# EAGLE design 1LFO_v2 (EAGLE 7.1.0)
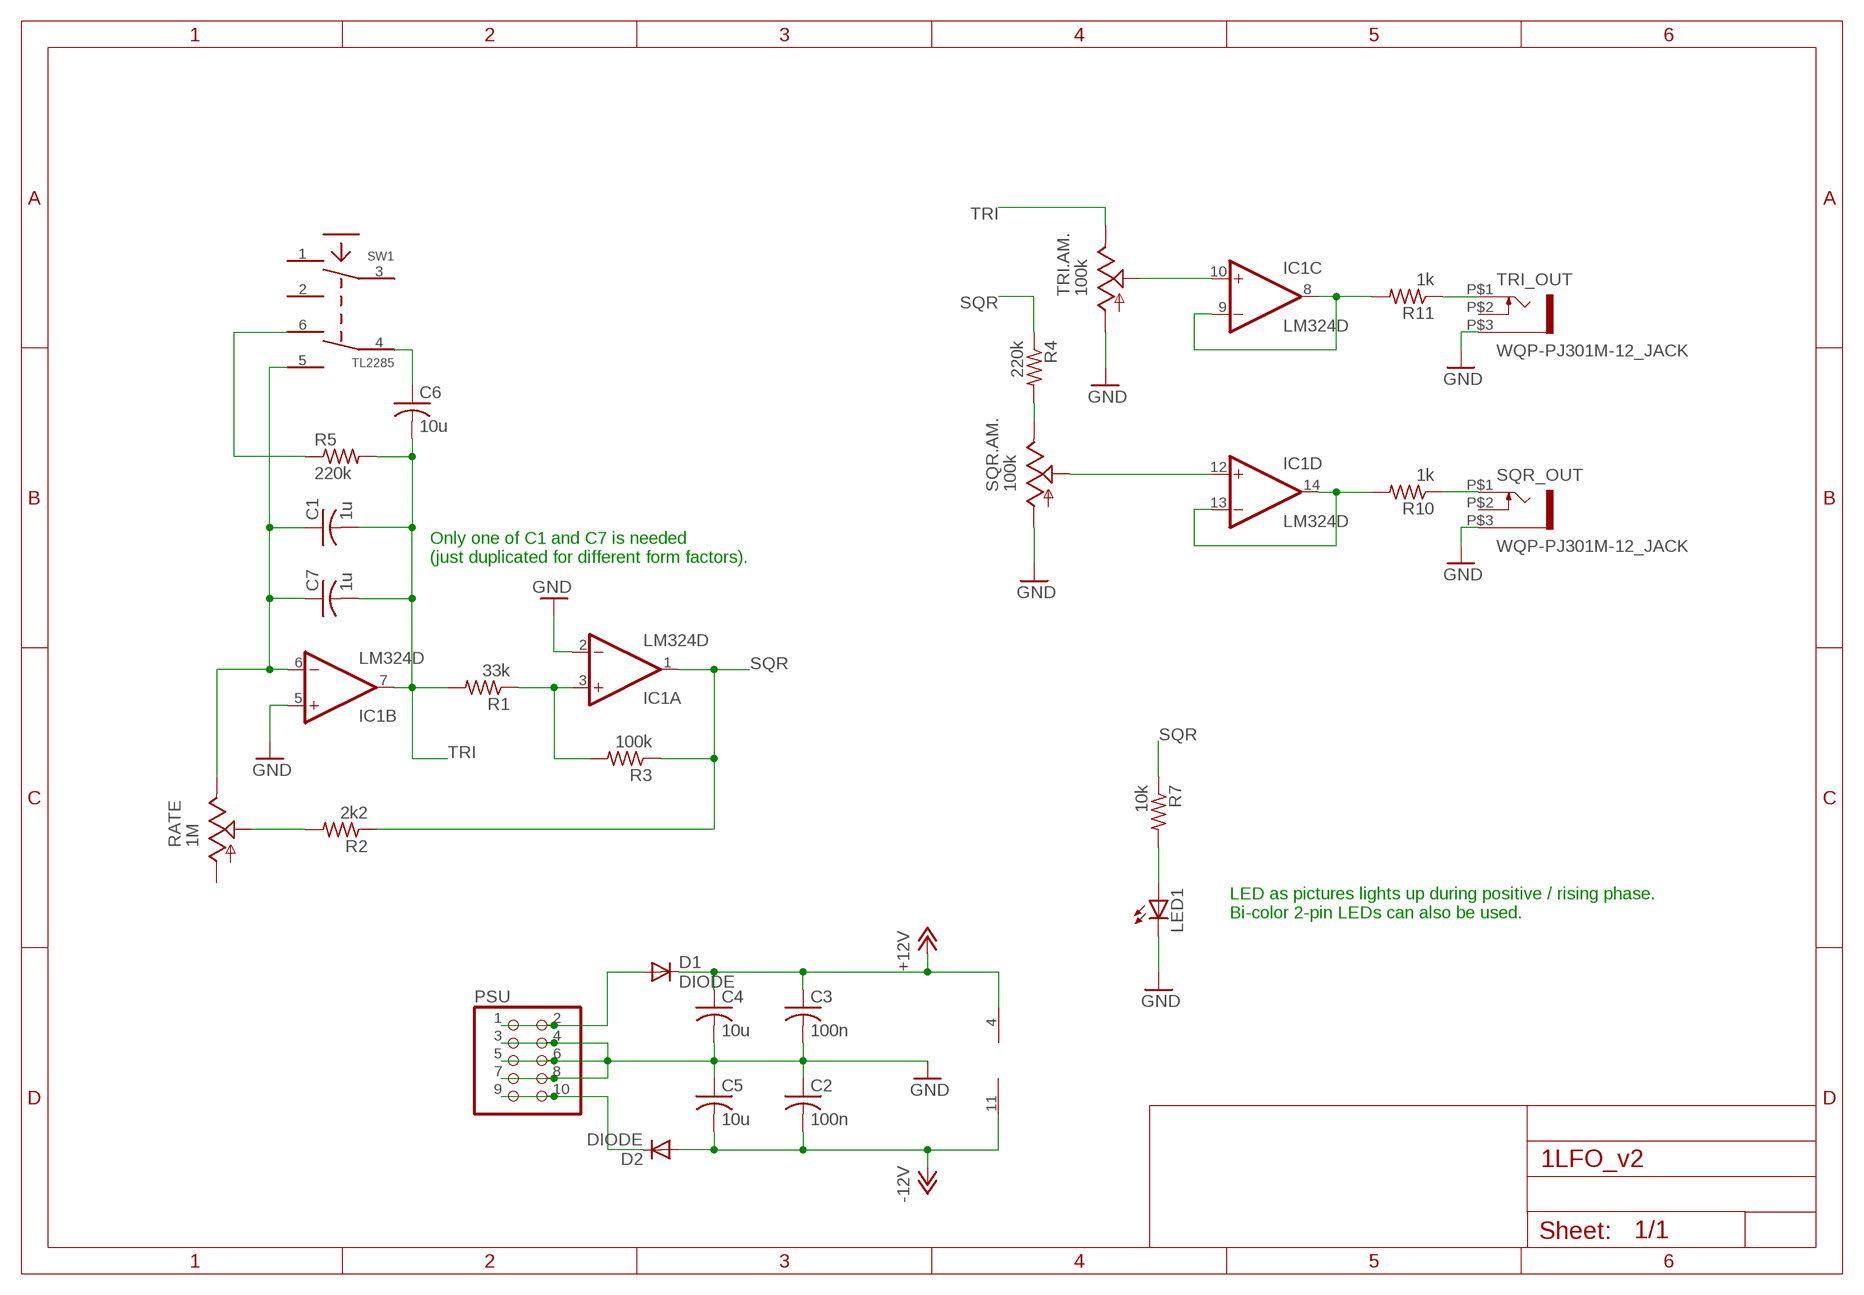
[diagram p0: schematic, sheet 1]

## Parts
C1  1u  C-USC1206K  [C1206K]
C2  100n  C-USC0603K  [C0603K]
C3  100n  C-USC0603K  [C0603K]
C4  10u  C-USC1206K  [C1206K]
C5  10u  C-USC1206K  [C1206K]
C6  10u  C-USC1206K  [C1206K]
C7  1u  C-USC0603K  [C0603K]
D1  DIODE  DIODE-DO214AA  [DO214AA]
D2  DIODE  DIODE-DO214AA  [DO214AA]
IC1  LM324D  [SO14]
LED1  LED5MM  [LED5MM]
PSU  PINHD-2X5  [2X05]
R1  33k  R-US_R0603  [R0603]
R2  2k2  R-US_R0603  [R0603]
R3  100k  R-US_R0603  [R0603]
R4  220k  R-US_R0603  [R0603]
R5  220k  R-US_R0603  [R0603]
R7  10k  R-US_R0603  [R0603]
R10  1k  R-US_R0603  [R0603]
R11  1k  R-US_R0603  [R0603]
RATE  1M  POT_USVERTICAL  [ALPS_POT_VERTICAL]
SQR.AM.  100k  POT_USVERTICAL  [ALPS_POT_VERTICAL]
SQR_OUT  WQP-PJ301M-12_JACK  [WQP-PJ301M-12_JACK]
SW1  TL2285  [TL2285_PCB]
TRI.AM.  100k  POT_USVERTICAL  [ALPS_POT_VERTICAL]
TRI_OUT  WQP-PJ301M-12_JACK  [WQP-PJ301M-12_JACK]

## Nets
+12V: C3.1 C4.1 D1.C IC1.4(P:V+)
-12V: C2.2 C5.2 D2.A IC1.11(P:V-)
GND: C2.1 C3.2 C4.2 C5.1 IC1.2(A:-IN) IC1.5(B:+IN) LED1.K(C) PSU.3 PSU.4 PSU.5 PSU.6 PSU.7 PSU.8 SQR.AM..P$3(A) SQR_OUT.P$3 TRI.AM..P$3(A) TRI_OUT.P$3
N$1: C1.1 C7.1 IC1.6(B:-IN) RATE.P$1(E) SW1.5
N$2: IC1.12(D:+IN) SQR.AM..P$2(S)
N$3: R4.2 SQR.AM..P$1(E)
N$4: C6.1 SW1.4
N$5: IC1.3(A:+IN) R1.1 R3.2
N$6: R5.1 SW1.6
N$7: R2.2 RATE.P$2(S)
N$8: IC1.8(C:OUT) IC1.9(C:-IN) R11.2
N$9: IC1.10(C:+IN) TRI.AM..P$2(S)
N$10: D1.A PSU.1 PSU.2
N$11: D2.C PSU.9 PSU.10
N$13: LED1.A R7.2
N$14: IC1.13(D:-IN) IC1.14(D:OUT) R10.2
N$17: R11.1 TRI_OUT.P$1
N$19: R10.1 SQR_OUT.P$1
SQR: IC1.1(A:OUT) R2.1 R3.1 R4.1 R7.1
TRI: C1.2 C6.2 C7.2 IC1.7(B:OUT) R1.2 R5.2 TRI.AM..P$1(E)
Unconnected: RATE.P$3(A) SQR_OUT.P$2 SW1.1 SW1.2 SW1.3 TRI_OUT.P$2

## Notes on the sheet
- Only one of C1 and C7 is needed
  (just duplicated for different form factors).
- LED as pictures lights up during positive / rising phase. 
  Bi-color 2-pin LEDs can also be used.

## Library data of the parts
C1-C7 = rcl:C-US: CAPACITOR, American symbol
D1 D2 = diode:DIODE-: DIODE
IC1 = linear:LM324: OP AMP
LED1 = led:LED: LED OSRAM: - CHIPLED LG R971, LG N971, LY N971, LG Q971, LY Q971, LO R971, LY R971 LH N974, LH R974 LS Q976, LO Q976, LY Q976 LO Q996 - Hyper CHIPLED LW Q18S LB Q993, LB Q99A, LB R99A - SideLED LS A670, LO A670, LY A670, LG A670, LP A670 LB A673, LV A673, LT A673, LW A673 LH A674 LY A675 LS A676, LA A676, LO A676, LY A676, LW A676 LS A679, LY A679, LG A679 - Hyper Micro SIDELED® LS Y876, LA Y876, LO Y876, LY Y876 LT Y87S - SmartLED LW L88C, LW L88S LB L89C, LB L89S, LG L890 LS L89K, LO L89K, LY L89K LS L896, LA L896, LO L896, LY L896 - TOPLED LS T670, LO T670, LY T670, LG T670, LP T670 LSG T670, LSP T670, LSY T670, LOP T670, LYG T670 LG T671, LOG T671, LSG T671 LB T673, LV T673, LT T673, LW T673 LH T674 LS T676, LA T676, LO T676, LY T676, LB T676, LH T676, LSB T676, LW T676 LB T67C, LV T67C, LT T67C, LS T67K, LO T67K, LY T67K, LW E67C LS E67B, LA E67B, LO E67B, LY E67B, LB E67C, LV E67C, LT E67C LW T67C LS T679, LY T679, LG T679 LS T770, LO T770, LY T770, LG T770, LP T770 LB T773, LV T773, LT T773, LW T773 LH T774 LS E675, LA E675, LY E675, LS T675 LS T776, LA T776, LO T776, LY T776, LB T776 LHGB T686 LT T68C, LB T68C - Hyper Mini TOPLED® LB M676 - Mini TOPLED Santana® LG M470 LS M47K, LO M47K, LY M47K Source: http://www.osram.convergy.de LUXEON: - LUMILED® LXK2-PW12-R00, LXK2-PW12-S00, LXK2-PW14-U00, LXK2-PW14-V00 LXK2-PM12-R00, LXK2-PM12-S00, LXK2-PM14-U00 LXK2-PE12-Q00, LXK2-PE12-R00, LXK2-PE12-S00, LXK2-PE14-T00, LXK2-PE14-U00 LXK2-PB12-K00, LXK2-PB12-L00, LXK2-PB12-M00, LXK2-PB14-N00, LXK2-PB14-P00, LXK2-PB14-Q00 LXK2-PR12-L00, LXK2-PR12-M00, LXK2-PR14-Q00, LXK2-PR14-R00 LXK2-PD12-Q00, LXK2-PD12-R00, LXK2-PD12-S00 LXK2-PH12-R00, LXK2-PH12-S00 LXK2-PL12-P00, LXK2-PL12-Q00, LXK2-PL12-R00 Source: www.luxeon.com KINGBRIGHT: KA-3528ASYC Source: www.kingbright.com
PSU = pinhead:PINHD-2X5: PIN HEADER
R1-R5 R7 R10 R11 = rcl:R-US_: RESISTOR, American symbol
RATE SQR.AM. TRI.AM. = pot-alps:POT_US
SQR_OUT TRI_OUT = thonkiconn:WQP-PJ301M-12_JACK
SW1 = lb_devs:TL2285: E-Switch TL2285 (PCB switch)

## Board
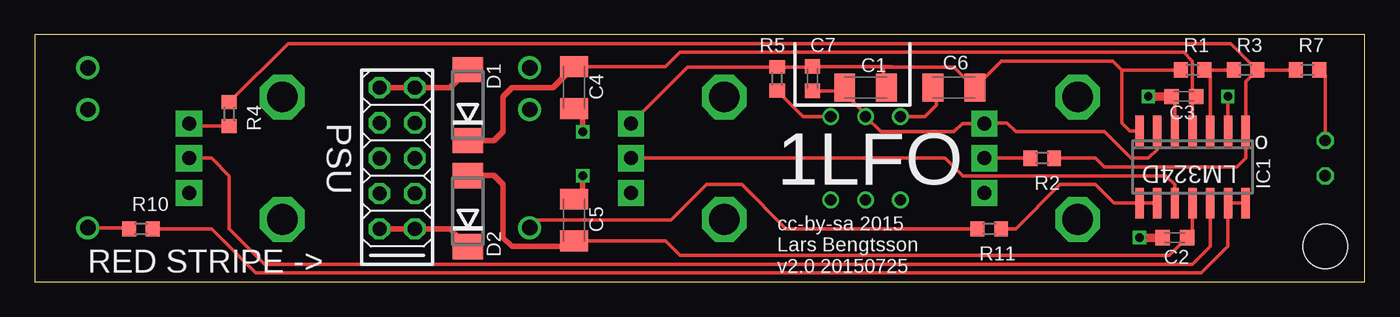
[diagram p1: board, top side]
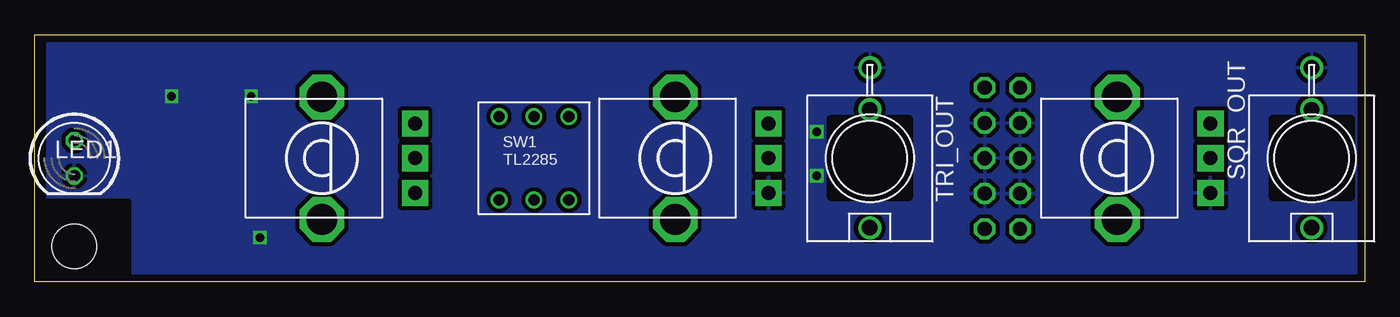
[diagram p2: board, bottom side, seen from below]

Size 95.55 x 17.77 mm. Coordinates in mm from the lower left corner, seen from the top.
Outline: 0,0 95.55,0 95.55,17.77 0,17.77 0,0
Copper layers (1*16): Top 0.0356mm / dielectric 1.5011mm / Bottom 0.0356mm
Design rules "LaenPCBOrder *": minimum track width 6mil, minimum drill 13mil, track to track 6mil, track to pad 6mil, pad to pad 6mil, via to via 6mil, smd to smd 6mil, copper to edge 15mil, drill to drill 6mil, minimum pad ring 7mil, minimum via ring 7mil, stop-mask expansion 3mil, vias tented up to drill 0mil, thermal gap 12mil
Holes 3.2 mm at 92.71,2.54
bRestrict: area 88.9,0.6 to 95.2,5.7

### Footprints (pad centres in the part's own frame; a part is rotated, then mirrored left to right if it is on the bottom)
C1206K = smd 1.5 x 2: 1 -1.5,0; 2 1.5,0
C0603K = smd 1.05 x 1.08: 1 -0.875,0; 2 0.875,0
DO214AA = smd 1.8 x 2.2: A 2.55,0; C -2.55,0
SO14 = smd 0.6 x 2.2: 1 -3.81,-2.6; 2 -2.54,-2.6; 3 -1.27,-2.6; 4 0,-2.6; 5 1.27,-2.6; 6 2.54,-2.6; 7 3.81,-2.6; 8 3.81,2.6; 9 2.54,2.6; 10 1.27,2.6; 11 0,2.6; 12 -1.27,2.6; 13 -2.54,2.6; 14 -3.81,2.6
LED5MM = drill 0.813 octagon: A -1.27,0; K 1.27,0
2X05 = drill 1.016 octagon: 1 -5.08,-1.27; 2 -5.08,1.27; 3 -2.54,-1.27; 4 -2.54,1.27; 5 0,-1.27; 6 0,1.27; 7 2.54,-1.27; 8 2.54,1.27; 9 5.08,-1.27; 10 5.08,1.27
R0603 = smd 1 x 1.1: 1 -0.85,0; 2 0.85,0
ALPS_POT_VERTICAL = drill 1 pad 1.88 square: P$1 -2.5,6.7; P$2 0,6.7; P$3 2.5,6.7 | drill 2.2 pad 3.175 octagon: P$4 -4.4,0; P$5 4.4,0
WQP-PJ301M-12_JACK = drill 1.1: P$1 0,5; P$2 0,-3.5; P$3 0,-6.5
TL2285_PCB = drill 0.8: 1 -2.5,-3; 2 0,-3; 3 2.5,-3; 4 -2.5,3; 5 0,3; 6 2.5,3

### Placement (x,y rotation side)
C1  59.69,13.97 0 top
C2  81.91,3.18 0 top
C3  82.55,13.34 180 top
C4  38.73,13.97 270 top
C5  38.73,4.45 270 top
C6  66.04,13.97 0 top
C7  55.88,14.61 90 top
D1  31.11,12.7 90 top
D2  31.11,5.08 90 top
IC1  83.19,8.26 180 top
LED1  92.71,8.89 270 bottom
PSU  26.04,8.89 270 top
R1  83.19,15.24 180 top
R2  72.39,8.89 180 top
R3  87,15.24 180 top
R4  13.97,12.07 270 top
R5  53.34,14.61 90 top
R7  91.44,15.24 0 top
R10  7.62,3.81 0 top
R11  68.58,3.81 0 top
RATE  74.93,8.89 270 bottom
SQR.AM.  17.78,8.89 270 bottom
SQR_OUT  3.81,8.89 180 bottom
SW1  59.69,8.89 0 bottom
TRI.AM.  49.53,8.89 270 bottom
TRI_OUT  35.56,8.89 180 bottom

### Tracks (layer width: path | path; a pad name or v marks a point on that pad's centre or on a via)
+12V
  Top 0.254: IC1.4 83.19,13.1 C3.1 83.19,13.58 83.19,15.88 82.55,16.51 46.35,16.51 45.31,15.47 C4.1
  Top 0.406: D1.C 33.01,10.15 33.66,10.79 33.66,13.34 34.29,13.97 37.23,13.97 C4.1
-12V
  Top 0.254: C5.2 45.31,2.94 46.35,1.9 81.52,1.9 C2.2 83.19,3.57 IC1.11
  Top 0.406: D2.A 33.01,7.63 33.66,6.99 33.66,3.18 34.29,2.54 38.33,2.54 C5.2
GND  (via drill 0.6)
  Top 0.254: v85.72,13.34 IC1.2 | IC1.5 81.91,13.1 C3.2
  Top 0.406: v39.37,10.79 39.37,11.84 C4.2 | v39.37,7.62 39.37,6.58 C5.1
  Top 0.61: C2.1 v79.38,3.18 | C3.2 v80.01,13.34
  pour Bottom (isolate 0.305): 0.64,17.14 94.61,17.14 94.61,0.64 0.64,0.64
N$1
  Top 0.254: IC1.6 80.64,9.53 80.01,8.89 78.74,8.89 76.83,10.79 70.48,10.79 69.85,11.43 68.27,11.43 RATE.P$1 66.63,11.39 66.04,10.79 60.78,10.79 SW1.5 59.69,12.07 58.42,13.34 58.42,13.74 C1.1 57.95,13.73 C7.1
N$2
  Top 0.254: IC1.12 84.45,2.54 83.19,1.27 16.51,1.27 13.97,3.81 13.97,7.62 12.7,8.89 SQR.AM..P$2
N$3
  Top 0.254: R4.2 11.25,11.21 SQR.AM..P$1
N$4
  Top 0.254: SW1.4 63.96,11.89 64.77,12.7 64.77,13.74 C6.1
N$5
  Top 0.254: IC1.3 84.45,14.82 R1.1 R3.2
N$6
  Top 0.254: SW1.6 55.2,11.89 R5.1
N$7
  Top 0.254: RATE.P$2 R2.2
N$8
  Top 0.254: IC1.9 IC1.8 77.53,5.65 76.2,6.99 73.66,6.99 70.48,3.81 R11.2
N$9
  Top 0.254: TRI.AM..P$2 65.41,8.89 66.67,7.62 81.28,7.62 81.91,6.99 IC1.10
N$10
  Top 0.406: PSU.1 PSU.2 29.84,13.97 D1.A
N$11
  Top 0.406: PSU.9 PSU.10 29.84,3.81 D2.C
N$13
  Top 0.254: LED1.A 92.71,14.82 R7.2
N$14
  Top 0.254: IC1.14 IC1.13 85.72,2.54 83.82,0.64 15.87,0.64 12.7,3.81 R10.2
N$17
  Top 0.254: R11.1 53.97,3.81 50.8,6.99 48.26,6.99 45.72,4.45 36.11,4.45 TRI_OUT.P$1
N$19
  Top 0.254: SQR_OUT.P$1 6.69,3.89 R10.1
SQR
  Top 0.254: R4.1 18.2,17.14 85.94,17.14 R3.1 | R2.1 76.2,8.89 76.83,8.26 86.36,8.26 87,8.89 IC1.1 87,14.39 R3.1 | 87.63,15.46 R3.1 | R7.1 R3.1
TRI
  Top 0.254: C1.2 60.96,13.97 60.96,15.46 61.59,15.46 | TRI.AM..P$1 46.89,15.46 R5.2 55.85,15.46 C7.2 61.57,15.48 61.59,15.46 | IC1.7 78.68,10.86 78.11,11.43 78.11,15.24 | R1.2 78.11,15.24 | 78.11,15.24 77.47,15.88 69.44,15.88 C6.2 66.05,15.46 61.59,15.46

### Text on the board
tNames: o | 1LFO | RED STRIPE -> | cc-by-sa 2015 / Lars Bengtsson / v2.0 20150725